# EAGLE design usb-current-limiter (EAGLE 7.7.0)
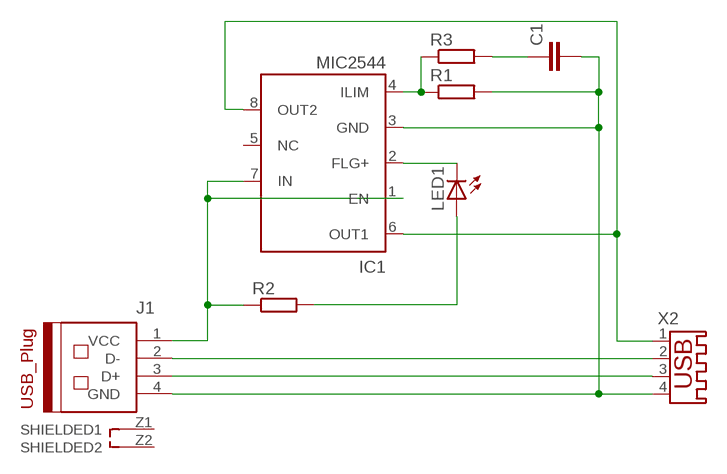
[diagram p0: schematic, sheet 1]

## Parts
C1  C-EUC0805K  [C0805K]
IC1  MIC2544  MCP3550-50SN  [SO-08]
J1  629004113921  [629004113921]
LED1  LEDCHIPLED_0805  [CHIPLED_0805]
R1  R-EU_M0805  [M0805]
R2  R-EU_M0805  [M0805]
R3  R-EU_M0805  [M0805]
X2  USB-A003  [USB-A003]

## Nets
N$1: IC1.1(EN) IC1.7(IN) J1.1(VCC) R2.1
N$2: J1.2(D-) X2.2
N$3: J1.3(D+) X2.3
N$4: C1.2 IC1.3(GND) J1.4(GND) R1.2 X2.4
N$5: IC1.6(OUT1) IC1.8(OUT2) X2.1
N$7: IC1.4(ILIM) R1.1 R3.1
N$8: IC1.2(FLG+) LED1.C
N$9: LED1.A R2.2
N$10: C1.1 R3.2
Unconnected: IC1.5(NC) J1.Z1(SHIELDED1) J1.Z2(SHIELDED2)

## Library data of the parts
C1 = rcl:C-EU: CAPACITOR, European symbol
IC1 = microchip:MCP355*: Low-Power, Single-Channel 22-Bit Delta-Sigma ADCs Source: http://ww1.microchip.com/downloads/en/DeviceDoc/21950c.pdf; MF: MICROCHIP; MPN: MIC2544-50-E/SN; OC_FARNELL: 1557411; OC_NEWARK: 69K0131
J1 = Wurth_Elektronik_Electromechanic_Input-Output_Connectors_rev16a:629004113921: WR-COM Plug SMT With Clip USB Type A,4 pins=>Code : Con_I-O_COM_USB-2.0_A_629004113921 <http://katalog.we-online.de/media/images/eican/Con_I-O_COM_USB-2.0_A_629004113921_pf2.jpg> Details see: http://katalog.we-online.de/en/em/629_004_113_921 Created 2014-07-09, Karrer Zheng 2014 (C) Würth Elektronik
LED1 = led:LED: LED OSRAM: - CHIPLED LG R971, LG N971, LY N971, LG Q971, LY Q971, LO R971, LY R971 LH N974, LH R974 LS Q976, LO Q976, LY Q976 LO Q996 - Hyper CHIPLED LW Q18S LB Q993, LB Q99A, LB R99A - SideLED LS A670, LO A670, LY A670, LG A670, LP A670 LB A673, LV A673, LT A673, LW A673 LH A674 LY A675 LS A676, LA A676, LO A676, LY A676, LW A676 LS A679, LY A679, LG A679 - Hyper Micro SIDELED® LS Y876, LA Y876, LO Y876, LY Y876 LT Y87S - SmartLED LW L88C, LW L88S LB L89C, LB L89S, LG L890 LS L89K, LO L89K, LY L89K LS L896, LA L896, LO L896, LY L896 - TOPLED LS T670, LO T670, LY T670, LG T670, LP T670 LSG T670, LSP T670, LSY T670, LOP T670, LYG T670 LG T671, LOG T671, LSG T671 LB T673, LV T673, LT T673, LW T673 LH T674 LS T676, LA T676, LO T676, LY T676, LB T676, LH T676, LSB T676, LW T676 LB T67C, LV T67C, LT T67C, LS T67K, LO T67K, LY T67K, LW E67C LS E67B, LA E67B, LO E67B, LY E67B, LB E67C, LV E67C, LT E67C LW T67C LS T679, LY T679, LG T679 LS T770, LO T770, LY T770, LG T770, LP T770 LB T773, LV T773, LT T773, LW T773 LH T774 LS E675, LA E675, LY E675, LS T675 LS T776, LA T776, LO T776, LY T776, LB T776 LHGB T686 LT T68C, LB T68C - Hyper Mini TOPLED® LB M676 - Mini TOPLED Santana® LG M470 LS M47K, LO M47K, LY M47K Source: http://www.osram.convergy.de LUXEON: - LUMILED® LXK2-PW12-R00, LXK2-PW12-S00, LXK2-PW14-U00, LXK2-PW14-V00 LXK2-PM12-R00, LXK2-PM12-S00, LXK2-PM14-U00 LXK2-PE12-Q00, LXK2-PE12-R00, LXK2-PE12-S00, LXK2-PE14-T00, LXK2-PE14-U00 LXK2-PB12-K00, LXK2-PB12-L00, LXK2-PB12-M00, LXK2-PB14-N00, LXK2-PB14-P00, LXK2-PB14-Q00 LXK2-PR12-L00, LXK2-PR12-M00, LXK2-PR14-Q00, LXK2-PR14-R00 LXK2-PD12-Q00, LXK2-PD12-R00, LXK2-PD12-S00 LXK2-PH12-R00, LXK2-PH12-S00 LXK2-PL12-P00, LXK2-PL12-Q00, LXK2-PL12-R00 Source: www.luxeon.com KINGBRIGHT: KA-3528ASYC Source: www.kingbright.com
R1-R3 = rcl:R-EU_: RESISTOR, European symbol
X2 = con-yamaichi:USB-A003: USB connector; OC_FARNELL: unknown; OC_NEWARK: unknown

## Board
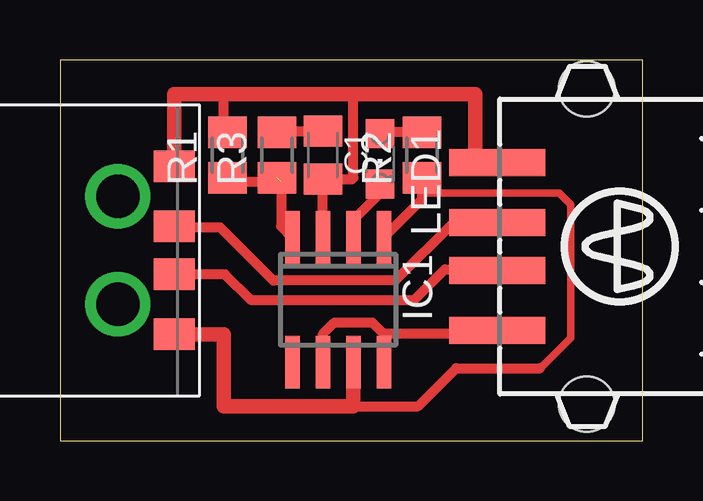
[diagram p1: board, top side]

Size 24.29 x 15.88 mm. Coordinates in mm from the lower left corner, seen from the top.
Outline: 0,0 24.29,0 24.29,15.88 0,15.88 0,0
Copper layers (1*16): Top 0.035mm / dielectric 1.5mm / Bottom 0.035mm
Design rules "default": minimum track width 10mil, minimum drill 24mil, track to track 8mil, track to pad 8mil, pad to pad 8mil, via to via 8mil, smd to smd 8mil, copper to edge 40mil, drill to drill 8mil, minimum pad ring 10mil, minimum via ring 8mil, stop-mask expansion 4mil, vias tented up to drill 0mil, thermal gap 10mil

### Footprints (pad centres in the part's own frame; a part is rotated, then mirrored left to right if it is on the bottom)
C0805K = smd 1.3 x 1.6: 1 -1,0; 2 1,0
SO-08 = smd 0.6 x 2.2: 1 -1.905,-2.6; 2 -0.635,-2.6; 3 0.635,-2.6; 4 1.905,-2.6; 5 1.905,2.6; 6 0.635,2.6; 7 -0.635,2.6; 8 -1.905,2.6
629004113921 = smd 1.3 x 1.7: 1 -3.5,0; 2 -1,0; 3 1,0; 4 3.5,0 | drill 1.8: Z1 -2.25,2.35; Z2 2.25,2.35
CHIPLED_0805 = smd 1.2 x 1.2: A 0,-1.05; C 0,1.05
M0805 = smd 1.3 x 1.6: 1 -0.95,0; 2 0.95,0
USB-A003 = smd 1.12 x 4: 1 -3.5,14; 2 -1,14; 3 1,14; 4 3.5,14 | hole 2.3: -6.57,10.28; 6.57,10.28

### Placement (x,y rotation side)
C1  10.95,11.91 270 top
IC1  11.59,5.87 180 top
J1  4.76,7.94 90 top
LED1  13.34,11.75 180 top
R1  6.99,11.91 90 top
R2  15.08,11.91 90 top
R3  9.05,11.91 90 top
X2  32.23,8.1 90 top

### Tracks (layer width: path | path; a pad name or v marks a point on that pad's centre or on a via)
N$1
  Top 0.305: 20,3.02 21.27,4.29 21.27,9.84 20.8,10.32 15.08,10.32 R2.1
  Top 0.406: 12.22,1.43 14.92,1.43 16.51,3.02 20,3.02 | R2.1 15.08,10.06 IC1.1
  Top 0.61: J1.1 6.83,4.44 6.83,1.43 12.22,1.43 IC1.7
N$2
  Top 0.406: X2.2 18.18,7.14 16.03,7.14 14.76,5.87 7.94,5.87 6.87,6.94 J1.2
N$3
  Top 0.406: X2.3 16.4,9.1 13.97,6.67 8.89,6.67 6.67,8.89 4.76,8.89 J1.3 4.76,9.05
N$4
  Top 0.406: 6.3,14.49 6.19,14.45 | 12.22,14.45 12.22,10.95 12.18,10.91 C1.2 IC1.3 | R1.2 6.83,12.86 6.83,14.45
  Top 0.61: X2.4 17.3,11.72 17.3,14.45 12.22,14.45 6.83,14.45 6.19,14.45 4.76,14.45 J1.4
N$5
  Top 0.406: IC1.6 10.95,4.45 11.43,4.92 13.02,4.92 13.49,4.45 | 13.49,4.45 IC1.8 | X2.1 18.07,4.45 13.49,4.45
N$7  (1 unrouted)
  Top 0.406: R1.1 6.99,10.79 9.21,10.79 9.21,8.95 IC1.4
N$8
  Top 0.406: IC1.2 12.22,9.21 13.34,10.32 LED1.C
N$9
  Top 0.406: R2.2 13.39,12.86 LED1.A
N$10
  Top 0.406: R3.2 9.1,12.91 C1.1